# Altium schematic sheet SENSOR.SchDoc
size A4; SheetNumber: 2; SheetTotal: 3
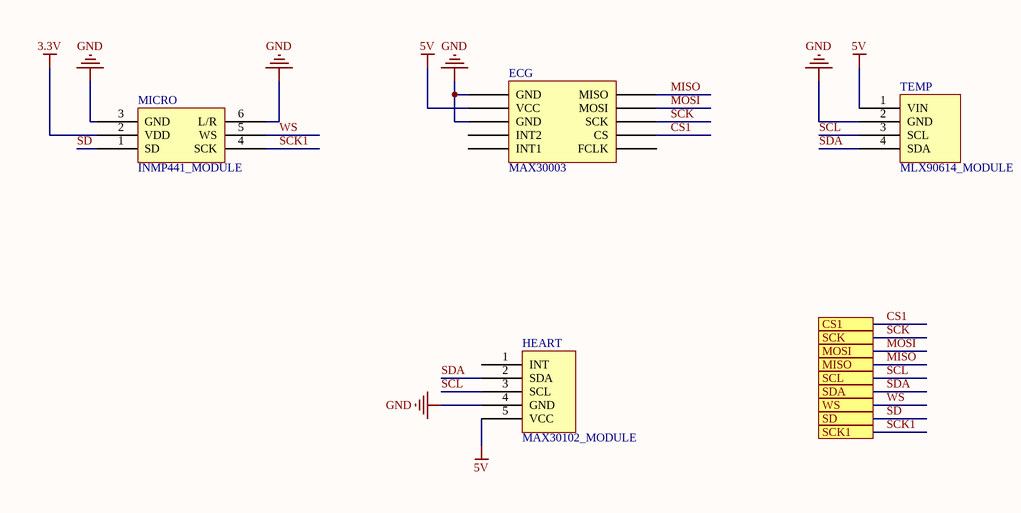
[diagram p0: SENSOR.SchDoc]

## Parts
ECG  MAX30003  [MAX30003]
HEART  MAX30102_MODULE  [MAX30102_module]
MICRO  INMP441_MODULE  [INMP441_MODULE]
TEMP  MLX90614_MODULE  [MLX90614_MODULE]

## Ports
CS1, MISO, MOSI, SCK, SCK1, SCL, SD, SDA, WS

## Nets
3.3V: MICRO.2(VDD)
5V: ECG.VCC HEART.5(VCC) TEMP.1(VIN)
GND: ECG.GND HEART.4(GND) MICRO.3(GND) MICRO.6(L/R) TEMP.2(GND)
CS1: ECG.CS ; port CS1
MISO: ECG.MISO ; port MISO
MOSI: ECG.MOSI ; port MOSI
SCK: ECG.SCK ; port SCK
SCK1: MICRO.4(SCK) ; port SCK1
SCL: HEART.3(SCL) TEMP.3(SCL) ; port SCL
SD: MICRO.1(SD) ; port SD
SDA: HEART.2(SDA) TEMP.4(SDA) ; port SDA
WS: MICRO.5(WS) ; port WS

Not connected (* = marked no-connect by the designer): ECG FCLK INT1 INT2; HEART 1(INT)